# Altium schematic sheet FPGA2.SchDoc
size A3
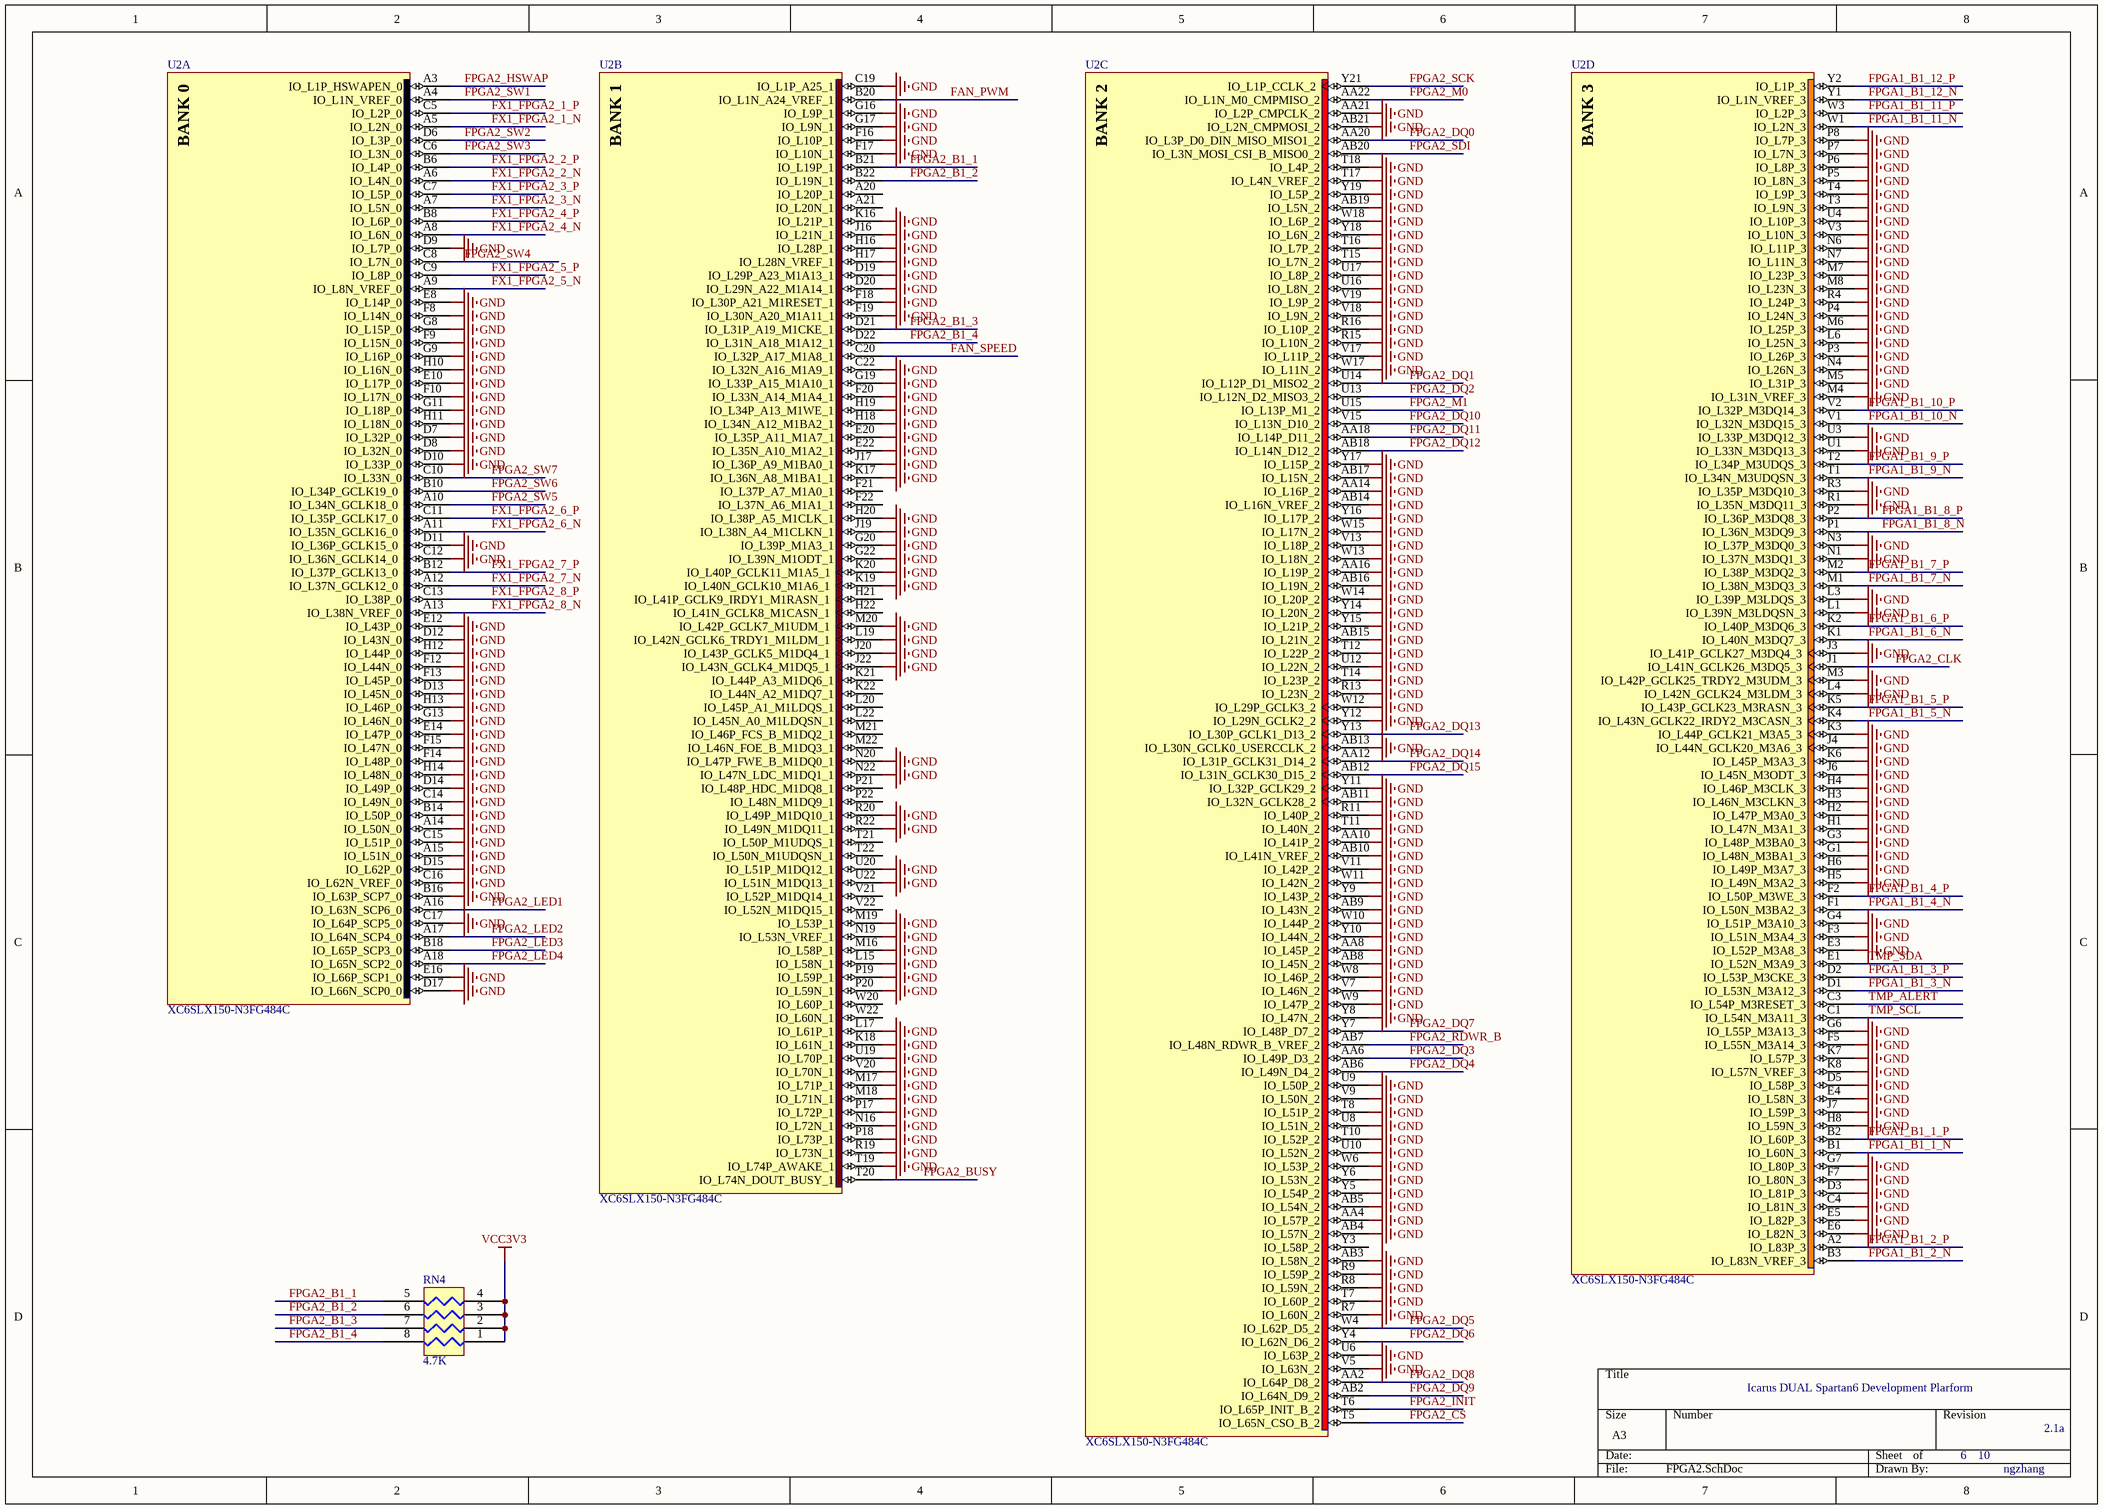
[diagram p0: FPGA2.SchDoc]

## Parts
RN4  4.7K  [EXBV8V]
U2  XC6SLX150-N3FG484C  [FG484]  (parts A,B,C,D of 7)

## Nets
GND: U2.A14(IO_L50N_0) U2.A15(IO_L51N_0) U2.AA4(IO_L57P_2) U2.AA8(IO_L45P_2) U2.AA10(IO_L41P_2) U2.AA14(IO_L16P_2) U2.AA16(IO_L19P_2) U2.AA21(IO_L2P_CMPCLK_2) U2.AB3(IO_L58N_2) U2.AB4(IO_L57N_2) U2.AB5(IO_L54N_2) U2.AB8(IO_L45N_2) U2.AB9(IO_L43N_2) U2.AB10(IO_L41N_VREF_2) U2.AB11(IO_L32N_GCLK28_2) U2.AB13(IO_L30N_GCLK0_USERCCLK_2) U2.AB14(IO_L16N_VREF_2) U2.AB15(IO_L21N_2) U2.AB16(IO_L19N_2) U2.AB17(IO_L15N_2) U2.AB19(IO_L5N_2) U2.AB21(IO_L2N_CMPMOSI_2) U2.B14(IO_L50P_0) U2.B16(IO_L63P_SCP7_0) U2.C4(IO_L81N_3) U2.C12(IO_L36N_GCLK14_0) U2.C14(IO_L49N_0) U2.C15(IO_L51P_0) U2.C16(IO_L62N_VREF_0) U2.C17(IO_L64P_SCP5_0) U2.C19(IO_L1P_A25_1) U2.C22(IO_L32N_A16_M1A9_1) U2.D3(IO_L81P_3) U2.D5(IO_L58P_3) U2.D7(IO_L32P_0) U2.D8(IO_L32N_0) U2.D9(IO_L7P_0) U2.D10(IO_L33P_0) U2.D11(IO_L36P_GCLK15_0) U2.D12(IO_L43N_0) U2.D13(IO_L45N_0) U2.D14(IO_L49P_0) U2.D15(IO_L62P_0) U2.D17(IO_L66N_SCP0_0) U2.D19(IO_L29P_A23_M1A13_1) U2.D20(IO_L29N_A22_M1A14_1) U2.E3(IO_L52P_M3A8_3) U2.E4(IO_L58N_3) U2.E5(IO_L82P_3) U2.E6(IO_L82N_3) U2.E8(IO_L14P_0) U2.E10(IO_L17P_0) U2.E12(IO_L43P_0) U2.E14(IO_L47P_0) U2.E16(IO_L66P_SCP1_0) U2.E20(IO_L35P_A11_M1A7_1) U2.E22(IO_L35N_A10_M1A2_1) U2.F3(IO_L51N_M3A4_3) U2.F5(IO_L55N_M3A14_3) U2.F7(IO_L80N_3) U2.F8(IO_L14N_0) U2.F9(IO_L15N_0) U2.F10(IO_L17N_0) U2.F12(IO_L44N_0) U2.F13(IO_L45P_0) U2.F14(IO_L48P_0) U2.F15(IO_L47N_0) U2.F16(IO_L10P_1) U2.F17(IO_L10N_1) U2.F18(IO_L30P_A21_M1RESET_1) U2.F19(IO_L30N_A20_M1A11_1) U2.F20(IO_L33N_A14_M1A4_1) U2.G1(IO_L48N_M3BA1_3) U2.G3(IO_L48P_M3BA0_3) U2.G4(IO_L51P_M3A10_3) U2.G6(IO_L55P_M3A13_3) U2.G7(IO_L80P_3) U2.G8(IO_L15P_0) U2.G9(IO_L16P_0) U2.G11(IO_L18P_0) U2.G13(IO_L46N_0) U2.G16(IO_L9P_1) U2.G17(IO_L9N_1) U2.G19(IO_L33P_A15_M1A10_1) U2.G20(IO_L39P_M1A3_1) U2.G22(IO_L39N_M1ODT_1) U2.H1(IO_L47N_M3A1_3) U2.H2(IO_L47P_M3A0_3) U2.H3(IO_L46N_M3CLKN_3) U2.H4(IO_L46P_M3CLK_3) U2.H5(IO_L49N_M3A2_3) U2.H6(IO_L49P_M3A7_3) U2.H8(IO_L59N_3) U2.H10(IO_L16N_0) U2.H11(IO_L18N_0) U2.H12(IO_L44P_0) U2.H13(IO_L46P_0) U2.H14(IO_L48N_0) U2.H16(IO_L28P_1) U2.H17(IO_L28N_VREF_1) U2.H18(IO_L34N_A12_M1BA2_1) U2.H19(IO_L34P_A13_M1WE_1) U2.H20(IO_L38P_A5_M1CLK_1) U2.J3(IO_L41P_GCLK27_M3DQ4_3) U2.J4(IO_L44N_GCLK20_M3A6_3) U2.J6(IO_L45N_M3ODT_3) U2.J7(IO_L59P_3) U2.J16(IO_L21N_1) U2.J17(IO_L36P_A9_M1BA0_1) U2.J19(IO_L38N_A4_M1CLKN_1) U2.J20(IO_L43P_GCLK5_M1DQ4_1) U2.J22(IO_L43N_GCLK4_M1DQ5_1) U2.K3(IO_L44P_GCLK21_M3A5_3) U2.K6(IO_L45P_M3A3_3) U2.K7(IO_L57P_3) U2.K8(IO_L57N_VREF_3) U2.K16(IO_L21P_1) U2.K17(IO_L36N_A8_M1BA1_1) U2.K18(IO_L61N_1) U2.K19(IO_L40N_GCLK10_M1A6_1) U2.K20(IO_L40P_GCLK11_M1A5_1) U2.L1(IO_L39N_M3LDQSN_3) U2.L3(IO_L39P_M3LDQS_3) U2.L4(IO_L42N_GCLK24_M3LDM_3) U2.L6(IO_L25N_3) U2.L15(IO_L58N_1) U2.L17(IO_L61P_1) U2.L19(IO_L42N_GCLK6_TRDY1_M1LDM_1) U2.M3(IO_L42P_GCLK25_TRDY2_M3UDM_3) U2.M4(IO_L31N_VREF_3) U2.M5(IO_L31P_3) U2.M6(IO_L25P_3) U2.M7(IO_L23P_3) U2.M8(IO_L23N_3) U2.M16(IO_L58P_1) U2.M17(IO_L71P_1) U2.M18(IO_L71N_1) U2.M19(IO_L53P_1) U2.M20(IO_L42P_GCLK7_M1UDM_1) U2.N1(IO_L37N_M3DQ1_3) U2.N3(IO_L37P_M3DQ0_3) U2.N4(IO_L26N_3) U2.N6(IO_L11P_3) U2.N7(IO_L11N_3) U2.N16(IO_L72N_1) U2.N19(IO_L53N_VREF_1) U2.N20(IO_L47P_FWE_B_M1DQ0_1) U2.N22(IO_L47N_LDC_M1DQ1_1) U2.P3(IO_L26P_3) U2.P4(IO_L24N_3) U2.P5(IO_L8N_3) U2.P6(IO_L8P_3) U2.P7(IO_L7N_3) U2.P8(IO_L7P_3) U2.P17(IO_L72P_1) U2.P18(IO_L73P_1) U2.P19(IO_L59P_1) U2.P20(IO_L59N_1) U2.R1(IO_L35N_M3DQ11_3) U2.R3(IO_L35P_M3DQ10_3) U2.R4(IO_L24P_3) U2.R7(IO_L60N_2) U2.R8(IO_L59N_2) U2.R9(IO_L59P_2) U2.R11(IO_L40P_2) U2.R13(IO_L23N_2) U2.R15(IO_L10N_2) U2.R16(IO_L10P_2) U2.R19(IO_L73N_1) U2.R20(IO_L49P_M1DQ10_1) U2.R22(IO_L49N_M1DQ11_1) U2.T3(IO_L9N_3) U2.T4(IO_L9P_3) U2.T7(IO_L60P_2) U2.T8(IO_L51P_2) U2.T10(IO_L52P_2) U2.T11(IO_L40N_2) U2.T12(IO_L22P_2) U2.T14(IO_L23P_2) U2.T15(IO_L7N_2) U2.T16(IO_L7P_2) U2.T17(IO_L4N_VREF_2) U2.T18(IO_L4P_2) U2.T19(IO_L74P_AWAKE_1) U2.U1(IO_L33N_M3DQ13_3) U2.U3(IO_L33P_M3DQ12_3) U2.U4(IO_L10P_3) U2.U6(IO_L63P_2) U2.U8(IO_L51N_2) U2.U9(IO_L50P_2) U2.U10(IO_L52N_2) U2.U12(IO_L22N_2) U2.U16(IO_L8N_2) U2.U17(IO_L8P_2) U2.U19(IO_L70P_1) U2.U20(IO_L51P_M1DQ12_1) U2.U22(IO_L51N_M1DQ13_1) U2.V3(IO_L10N_3) U2.V5(IO_L63N_2) U2.V7(IO_L46N_2) U2.V9(IO_L50N_2) U2.V11(IO_L42P_2) U2.V13(IO_L18P_2) U2.V17(IO_L11P_2) U2.V18(IO_L9N_2) U2.V19(IO_L9P_2) U2.V20(IO_L70N_1) U2.W6(IO_L53P_2) U2.W8(IO_L46P_2) U2.W9(IO_L47P_2) U2.W10(IO_L44P_2) U2.W11(IO_L42N_2) U2.W12(IO_L29P_GCLK3_2) U2.W13(IO_L18N_2) U2.W14(IO_L20P_2) U2.W15(IO_L17N_2) U2.W17(IO_L11N_2) U2.W18(IO_L6P_2) U2.Y5(IO_L54P_2) U2.Y6(IO_L53N_2) U2.Y8(IO_L47N_2) U2.Y9(IO_L43P_2) U2.Y10(IO_L44N_2) U2.Y11(IO_L32P_GCLK29_2) U2.Y12(IO_L29N_GCLK2_2) U2.Y14(IO_L20N_2) U2.Y15(IO_L21P_2) U2.Y16(IO_L17P_2) U2.Y17(IO_L15P_2) U2.Y18(IO_L6N_2) U2.Y19(IO_L5P_2)
VCC3V3: RN4.1 RN4.2 RN4.3 RN4.4
FAN_PWM: U2.B20(IO_L1N_A24_VREF_1)
FAN_SPEED: U2.C20(IO_L32P_A17_M1A8_1)
FPGA1_B1_1_N: U2.B1(IO_L60N_3)
FPGA1_B1_1_P: U2.B2(IO_L60P_3)
FPGA1_B1_2_N: U2.B3(IO_L83N_VREF_3)
FPGA1_B1_2_P: U2.A2(IO_L83P_3)
FPGA1_B1_3_N: U2.D1(IO_L53N_M3A12_3)
FPGA1_B1_3_P: U2.D2(IO_L53P_M3CKE_3)
FPGA1_B1_4_N: U2.F1(IO_L50N_M3BA2_3)
FPGA1_B1_4_P: U2.F2(IO_L50P_M3WE_3)
FPGA1_B1_5_N: U2.K4(IO_L43N_GCLK22_IRDY2_M3CASN_3)
FPGA1_B1_5_P: U2.K5(IO_L43P_GCLK23_M3RASN_3)
FPGA1_B1_6_N: U2.K1(IO_L40N_M3DQ7_3)
FPGA1_B1_6_P: U2.K2(IO_L40P_M3DQ6_3)
FPGA1_B1_7_N: U2.M1(IO_L38N_M3DQ3_3)
FPGA1_B1_7_P: U2.M2(IO_L38P_M3DQ2_3)
FPGA1_B1_8_N: U2.P1(IO_L36N_M3DQ9_3)
FPGA1_B1_8_P: U2.P2(IO_L36P_M3DQ8_3)
FPGA1_B1_9_N: U2.T1(IO_L34N_M3UDQSN_3)
FPGA1_B1_9_P: U2.T2(IO_L34P_M3UDQS_3)
FPGA1_B1_10_N: U2.V1(IO_L32N_M3DQ15_3)
FPGA1_B1_10_P: U2.V2(IO_L32P_M3DQ14_3)
FPGA1_B1_11_N: U2.W1(IO_L2N_3)
FPGA1_B1_11_P: U2.W3(IO_L2P_3)
FPGA1_B1_12_N: U2.Y1(IO_L1N_VREF_3)
FPGA1_B1_12_P: U2.Y2(IO_L1P_3)
FPGA2_B1_1: RN4.5 U2.B21(IO_L19P_1)
FPGA2_B1_2: RN4.6 U2.B22(IO_L19N_1)
FPGA2_B1_3: RN4.7 U2.D21(IO_L31P_A19_M1CKE_1)
FPGA2_B1_4: RN4.8 U2.D22(IO_L31N_A18_M1A12_1)
FPGA2_BUSY: U2.T20(IO_L74N_DOUT_BUSY_1)
FPGA2_CLK: U2.J1(IO_L41N_GCLK26_M3DQ5_3)
FPGA2_CS: U2.T5(IO_L65N_CSO_B_2)
FPGA2_DQ0: U2.AA20(IO_L3P_D0_DIN_MISO_MISO1_2)
FPGA2_DQ1: U2.U14(IO_L12P_D1_MISO2_2)
FPGA2_DQ2: U2.U13(IO_L12N_D2_MISO3_2)
FPGA2_DQ3: U2.AA6(IO_L49P_D3_2)
FPGA2_DQ4: U2.AB6(IO_L49N_D4_2)
FPGA2_DQ5: U2.W4(IO_L62P_D5_2)
FPGA2_DQ6: U2.Y4(IO_L62N_D6_2)
FPGA2_DQ7: U2.Y7(IO_L48P_D7_2)
FPGA2_DQ8: U2.AA2(IO_L64P_D8_2)
FPGA2_DQ9: U2.AB2(IO_L64N_D9_2)
FPGA2_DQ10: U2.V15(IO_L13N_D10_2)
FPGA2_DQ11: U2.AA18(IO_L14P_D11_2)
FPGA2_DQ12: U2.AB18(IO_L14N_D12_2)
FPGA2_DQ13: U2.Y13(IO_L30P_GCLK1_D13_2)
FPGA2_DQ14: U2.AA12(IO_L31P_GCLK31_D14_2)
FPGA2_DQ15: U2.AB12(IO_L31N_GCLK30_D15_2)
FPGA2_HSWAP: U2.A3(IO_L1P_HSWAPEN_0)
FPGA2_INIT: U2.T6(IO_L65P_INIT_B_2)
FPGA2_LED1: U2.A16(IO_L63N_SCP6_0)
FPGA2_LED2: U2.A17(IO_L64N_SCP4_0)
FPGA2_LED3: U2.B18(IO_L65P_SCP3_0)
FPGA2_LED4: U2.A18(IO_L65N_SCP2_0)
FPGA2_M0: U2.AA22(IO_L1N_M0_CMPMISO_2)
FPGA2_M1: U2.U15(IO_L13P_M1_2)
FPGA2_RDWR_B: U2.AB7(IO_L48N_RDWR_B_VREF_2)
FPGA2_SCK: U2.Y21(IO_L1P_CCLK_2)
FPGA2_SDI: U2.AB20(IO_L3N_MOSI_CSI_B_MISO0_2)
FPGA2_SW1: U2.A4(IO_L1N_VREF_0)
FPGA2_SW2: U2.D6(IO_L3P_0)
FPGA2_SW3: U2.C6(IO_L3N_0)
FPGA2_SW4: U2.C8(IO_L7N_0)
FPGA2_SW5: U2.A10(IO_L34N_GCLK18_0)
FPGA2_SW6: U2.B10(IO_L34P_GCLK19_0)
FPGA2_SW7: U2.C10(IO_L33N_0)
FX1_FPGA2_1_N: U2.A5(IO_L2N_0)
FX1_FPGA2_1_P: U2.C5(IO_L2P_0)
FX1_FPGA2_2_N: U2.A6(IO_L4N_0)
FX1_FPGA2_2_P: U2.B6(IO_L4P_0)
FX1_FPGA2_3_N: U2.A7(IO_L5N_0)
FX1_FPGA2_3_P: U2.C7(IO_L5P_0)
FX1_FPGA2_4_N: U2.A8(IO_L6N_0)
FX1_FPGA2_4_P: U2.B8(IO_L6P_0)
FX1_FPGA2_5_N: U2.A9(IO_L8N_VREF_0)
FX1_FPGA2_5_P: U2.C9(IO_L8P_0)
FX1_FPGA2_6_N: U2.A11(IO_L35N_GCLK16_0)
FX1_FPGA2_6_P: U2.C11(IO_L35P_GCLK17_0)
FX1_FPGA2_7_N: U2.A12(IO_L37N_GCLK12_0)
FX1_FPGA2_7_P: U2.B12(IO_L37P_GCLK13_0)
FX1_FPGA2_8_N: U2.A13(IO_L38N_VREF_0)
FX1_FPGA2_8_P: U2.C13(IO_L38P_0)
TMP_ALERT: U2.C3(IO_L54P_M3RESET_3)
TMP_SCL: U2.C1(IO_L54N_M3A11_3)
TMP_SDA: U2.E1(IO_L52N_M3A9_3)

Not connected (* = marked no-connect by the designer): U2 A20(IO_L20P_1) A21(IO_L20N_1) F21(IO_L37P_A7_M1A0_1) F22(IO_L37N_A6_M1A1_1) H21(IO_L41P_GCLK9_IRDY1_M1RASN_1) H22(IO_L41N_GCLK8_M1CASN_1) K21(IO_L44P_A3_M1DQ6_1) K22(IO_L44N_A2_M1DQ7_1) L20(IO_L45P_A1_M1LDQS_1) L22(IO_L45N_A0_M1LDQSN_1) M21(IO_L46P_FCS_B_M1DQ2_1) M22(IO_L46N_FOE_B_M1DQ3_1) P21(IO_L48P_HDC_M1DQ8_1) P22(IO_L48N_M1DQ9_1) T21(IO_L50P_M1UDQS_1) T22(IO_L50N_M1UDQSN_1) V21(IO_L52P_M1DQ14_1) V22(IO_L52N_M1DQ15_1) W20(IO_L60P_1) W22(IO_L60N_1) Y3(IO_L58P_2)

## Notes on the sheet
- Icarus DUAL Spartan6 Development Plarform
- 6
- 10
- 2.1a
- ngzhang
- (in symbol XC6SLX150-N3FG484C, part A) BANK 0
- (in symbol XC6SLX150-N3FG484C, part B) BANK 1
- (in symbol XC6SLX150-N3FG484C, part C) BANK 2
- (in symbol XC6SLX150-N3FG484C, part D) BANK 3

## Library data of the parts
RN4 = RES4PACK
U2 = XC6SLX150-N3FG484C: Spartan-6 LX 1.2V FPGA, 338 User I/Os, 484-Ball Fine-Pitch BGA (1.0mm Pitch), Speed Grade 3N, Commercial Grade; Published: 24-Aug-2010; DatasheetVersion: ver1.6, Nov-2010; PackageVersion: ver1.1, Dec-2008; PackageReference: FG484; Publisher: Altium Limited; PackageDescription: 484-Ball Fine Pitch Ball Grid Array 1.00 mm Pitch (FG484); Code_JEDEC: MS-034-AAJ-1; Code_IPC: BGA100P22X22-484; ComponentLink1Description: Manufacturer Link; ComponentLink1URL: http://www.xilinx.com; ComponentLink2Description: Spartan-6 Datasheet; ComponentLink2URL: http://www.xilinx.com/support/documentation/data_sheets/ds160.pdf; ComponentLink3Description: Spartan-6 Documents; ComponentLink3URL: http://www.xilinx.com/support/documentation/spartan-6.htm; ComponentLink4Description: Xilinx.com Home; ComponentLink4URL: http://www.xilinx.com